# EAGLE design 16x8 mono LED FeatherWing rev A (EAGLE 6.4)
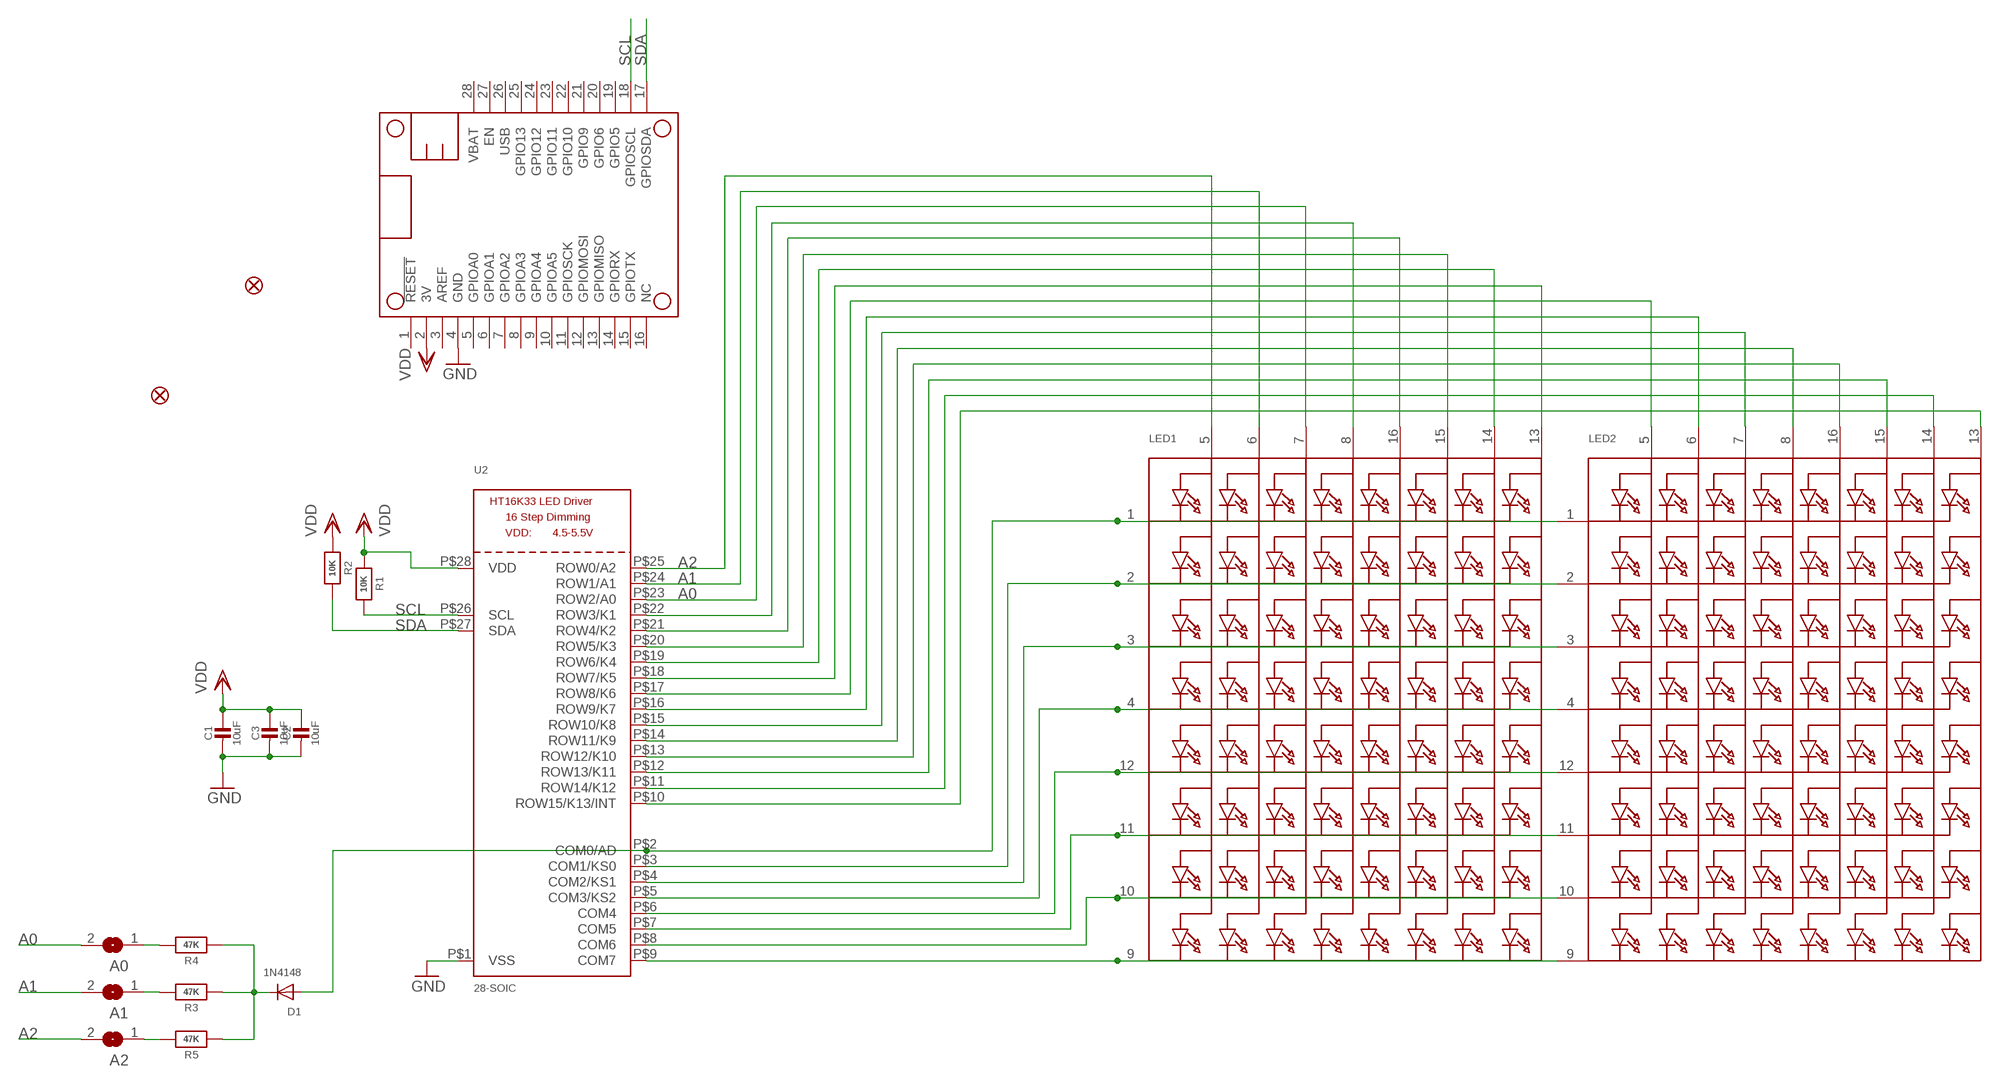
[diagram p0: schematic, sheet 1]

## Parts
A0  SOLDERJUMPERREFLOW_NOPASTE  [SOLDERJUMPER_REFLOW_NOPASTE]
A1  SOLDERJUMPERREFLOW_NOPASTE  [SOLDERJUMPER_REFLOW_NOPASTE]
A2  SOLDERJUMPERREFLOW_NOPASTE  [SOLDERJUMPER_REFLOW_NOPASTE]
C1  10uF  CAP_CERAMIC0805-NOOUTLINE  [0805-NO]
C2  10uF  CAP_CERAMIC0805-NOOUTLINE  [0805-NO]
C3  10uF  CAP_CERAMIC0805-NOOUTLINE  [0805-NO]
D1  1N4148  DIODESOD-323F  [SOD-323F]
FID1  FIDUCIAL""  [FIDUCIAL_1MM]
FID2  FIDUCIAL""  [FIDUCIAL_1MM]
LED1  DISP_SEGMENT_8X8_ROWCATHODE  [SEGMENT_BL-M07C881UR]
LED2  DISP_SEGMENT_8X8_ROWCATHODE  [SEGMENT_BL-M07C881UR]
MS1  FEATHERWING  [FEATHERWING]
R1  10K  RESISTOR0805_NOOUTLINE  [0805-NO]
R2  10K  RESISTOR0805_NOOUTLINE  [0805-NO]
R3  47K  RESISTOR0805_NOOUTLINE  [0805-NO]
R4  47K  RESISTOR0805_NOOUTLINE  [0805-NO]
R5  47K  RESISTOR0805_NOOUTLINE  [0805-NO]
U2  28-SOIC  HT16K33_SOP28_SKINNY  [SOP28_300MIL_SKINNY]

## Nets
A0: A0.2 LED1.7(A3) U2.P$23(ROW2/A0)
A1: A1.2 LED1.6(A2) U2.P$24(ROW1/A1)
A2: A2.2 LED1.5(A1) U2.P$25(ROW0/A2)
GND: C1.2 C2.2 C3.2 MS1.4(GND) U2.P$1(VSS)
N$1: LED1.9(K8) LED2.9(K8) U2.P$9(COM7)
N$2: LED1.10(K7) LED2.10(K7) U2.P$8(COM6)
N$3: LED1.11(K6) LED2.11(K6) U2.P$7(COM5)
N$4: LED1.12(K5) LED2.12(K5) U2.P$6(COM4)
N$5: LED1.4(K4) LED2.4(K4) U2.P$5(COM3/KS2)
N$6: LED1.3(K3) LED2.3(K3) U2.P$4(COM2/KS1)
N$7: LED1.2(K2) LED2.2(K2) U2.P$3(COM1/KS0)
N$8: D1.A LED1.1(K1) LED2.1(K1) U2.P$2(COM0/AD)
N$9: A2.1 R5.2
N$10: LED2.14(A7) U2.P$11(ROW14/K12)
N$11: LED2.15(A6) U2.P$12(ROW13/K11)
N$12: LED2.13(A8) U2.P$10(ROW15/K13/INT)
N$16: D1.C R3.1 R4.1 R5.1
N$19: A1.1 R3.2
N$20: A0.1 R4.2
N$22: LED1.13(A8) U2.P$18(ROW7/K5)
N$23: LED1.14(A7) U2.P$19(ROW6/K4)
N$25: LED1.16(A5) U2.P$21(ROW4/K2)
N$26: LED1.8(A4) U2.P$22(ROW3/K1)
N$35: LED1.15(A6) U2.P$20(ROW5/K3)
N$38: LED2.5(A1) U2.P$17(ROW8/K6)
N$39: LED2.6(A2) U2.P$16(ROW9/K7)
N$40: LED2.8(A4) U2.P$14(ROW11/K9)
N$41: LED2.7(A3) U2.P$15(ROW10/K8)
N$42: LED2.16(A5) U2.P$13(ROW12/K10)
SCL: MS1.18(GPIOSCL) R1.2 U2.P$26(SCL)
SDA: MS1.17(GPIOSDA) R2.2 U2.P$27(SDA)
VDD: C1.1 C2.1 C3.1 MS1.2(3V) R1.1 R2.1 U2.P$28(VDD)
Unconnected: MS1.1(!RESET) MS1.3(AREF) MS1.5(GPIOA0) MS1.6(GPIOA1) MS1.7(GPIOA2) MS1.8(GPIOA3) MS1.9(GPIOA4) MS1.10(GPIOA5) MS1.11(GPIOSCK) MS1.12(GPIOMOSI) MS1.13(GPIOMISO) MS1.14(GPIORX) MS1.15(GPIOTX) MS1.16(NC) MS1.19(GPIO5) MS1.20(GPIO6) MS1.21(GPIO9) MS1.22(GPIO10) MS1.23(GPIO11) MS1.24(GPIO12) MS1.25(GPIO13) MS1.26(USB) MS1.27(EN) MS1.28(VBAT)

## Library data of the parts
A0 A1 A2 = microbuilder:SOLDERJUMPER: SMD Solder JUMPER Solder the two pads together to create a connection, or remove the solder to break it. REFLOW - Use this footprint for solder paste and reflow ovens. WAVE - Use this footprint for hand-soldering (larger pads). CLOSED - Has a trace between the two pads to ensure it is closed by default. The trace needs to be cut to disable the jumper, and can be closed again by creating a solder bridge between the two pads.
C1-C3 = microbuilder:CAP_CERAMIC: Ceramic Capacitors For new designs, use the packages preceded by an '_' character since they are more reliable: The following footprints should be used on most boards: _0402 - Standard footprint for regular board layouts _0603 - Standard footprint for regular board layouts _0805 - Standard footprint for regular board layouts _1206 - Standard footprint for regular board layouts For extremely tight-pitch boards where space is at a premium, the following 'micro-pitch' footprints can be used (smaller pads, no silkscreen outline, etc.): _0402MP - Micro-pitch footprint for very dense/compact boards _0603MP - Micro-pitch footprint for very dense/compact boards _0805MP - Micro-pitch footprint for very dense/compact boards _1206MP - Micro-pitch footprint for very dense/compact boards
D1 = adafruit:DIODE: Diode SMADIODE - SMA Surface Mount Package 20V 1A Schottky Diode Digikey: 641-1014-6-ND DO-1N4148 - Through Hole Small Current Diode SOD-123 20V 1 A (.5mV Vf) Schottky Diode - Digikey: MBRX120TPMSCT-ND SOD-323 10V 570mA (.38mV Vf, 3ns) Schottky Diode - Digikey: ZLLS410CT-ND SOD-523 30V 30mA Schottky Diode (RB751S-40TE61) - Digikey: RB751S-40TE61CT-ND SOT23-R/W - SOT23 Package (R = Solder Paste/Reflow Ovens, W = Hand-Soldering) BAT54Film 40V 300mA - Digikey: 497-7162-1-ND
FID1 FID2 = microbuilder:FIDUCIAL: Fiducial Alignment Points Various fiducial points for machine vision alignment.; BOM: EXCLUDE
LED1 LED2 = microbuilder:DISP_SEGMENT_8X8_ROWCATHODE: 8x8 LED Segment Displays: Row = Cathode 0.7" Red 8X8 Matrix, 1.9mm Round LEDs - BL-M07C881UR 1.2" Red 8x8 Matrix, 3.0mm Round LEDs - BL-M12A881UR 1.2" Red 8x8 Matrix, 3.0mm Square LEDs - BL-M12A883
MS1 = microbuilder:FEATHERWING
R1-R5 = microbuilder:RESISTOR: Resistors For new designs, use the packages preceded by an '_' character since they are more reliable: The following footprints should be used on most boards: _0402 - Standard footprint for regular board layouts _0603 - Standard footprint for regular board layouts _0805 - Standard footprint for regular board layouts _1206 - Standard footprint for regular board layouts For extremely tight-pitch boards where space is at a premium, the following 'micro-pitch' footprints can be used (smaller pads, no silkscreen outline, etc.): _0402MP - Micro-pitch footprint for very dense/compact boards _0603MP - Micro-pitch footprint for very dense/compact boards _0805MP - Micro-pitch footprint for very dense/compact boards _1206MP - Micro-pitch footprint for very dense/compact boards
U2 = microbuilder:HT16K33_SOP28

## Board
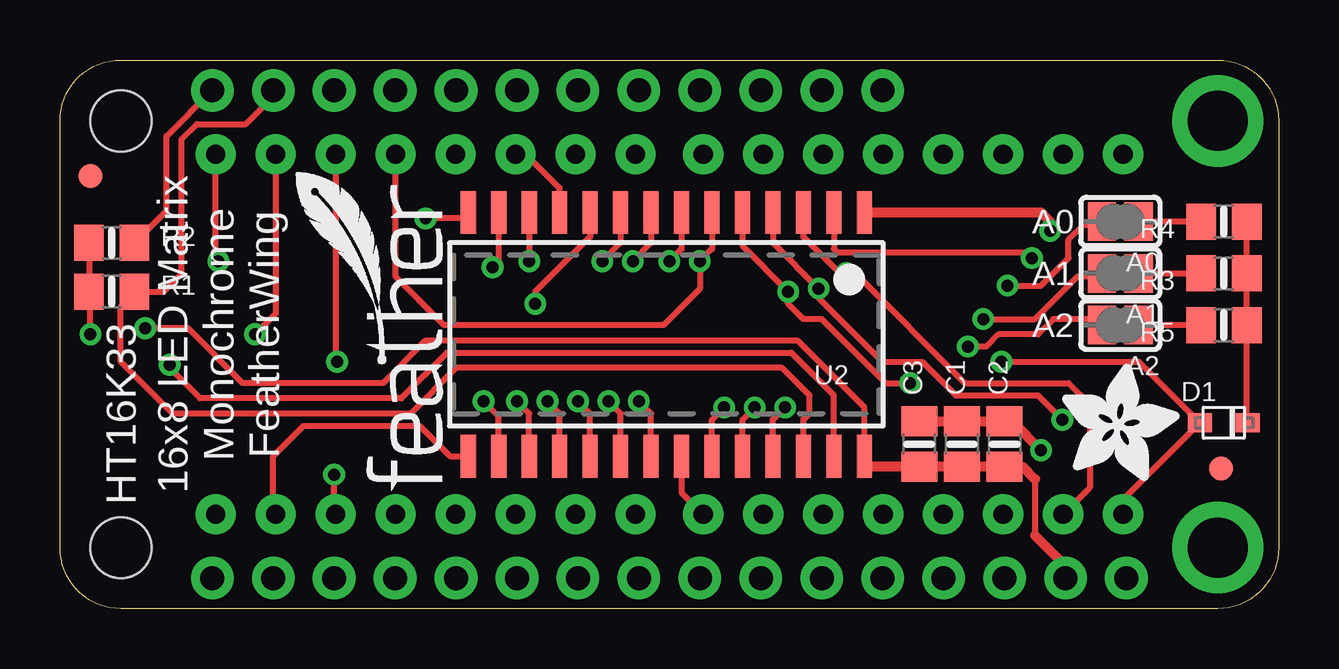
[diagram p1: board, top side]
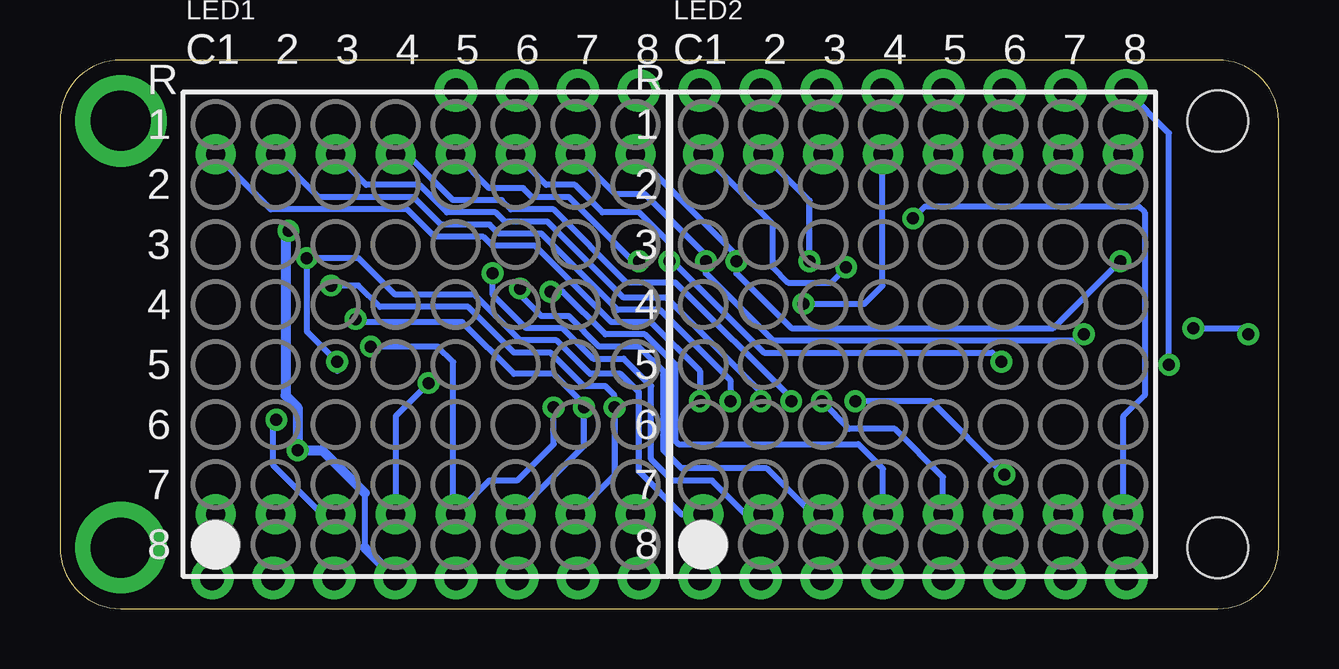
[diagram p2: board, bottom side, seen from below]

Size 50.8 x 22.86 mm. Coordinates in mm from the lower left corner, seen from the top.
Copper layers (1*16): Top 0.035mm / dielectric 1.5mm / Bottom 0.035mm
Design rules "adafruit *": minimum track width 8mil, minimum drill 15.5mil, track to track 8mil, track to pad 8mil, pad to pad 8mil, via to via 8mil, smd to smd 8mil, copper to edge 10mil, drill to drill 8mil, minimum pad ring 10mil, minimum via ring 8mil, stop-mask expansion 2mil, vias tented up to drill 20mil, thermal gap 10mil

### Footprints (pad centres in the part's own frame; a part is rotated, then mirrored left to right if it is on the bottom)
SOLDERJUMPER_REFLOW_NOPASTE = smd 1.168 x 1.6: 1 -0.762,0; 2 0.762,0
0805-NO = smd 1.24 x 1.5: 1 -0.95,0; 2 0.95,0
SOD-323F = smd 1 x 0.8: A -1,0; C 1,0
FIDUCIAL_1MM = smd 1 x 1: 1 0,0
SEGMENT_BL-M07C881UR = drill 0.8 pad 1.676: 1 -8.75,-7.5; 2 -6.25,-7.5; 3 -3.75,-7.5; 4 -1.25,-7.5; 5 1.25,-7.5; 6 3.75,-7.5; 7 6.25,-7.5; 8 8.75,-7.5; 9 8.75,7.5; 10 6.25,7.5; 11 3.75,7.5; 12 1.25,7.5; 13 -1.25,7.5; 14 -3.75,7.5; 15 -6.25,7.5; 16 -8.75,7.5
FEATHERWING = drill 1 pad 1.778: 1 6.35,1.27; 2 8.89,1.27; 3 11.43,1.27; 4 13.97,1.27; 5 16.51,1.27; 6 19.05,1.27; 7 21.59,1.27; 8 24.13,1.27; 9 26.67,1.27; 10 29.21,1.27; 11 31.75,1.27; 12 34.29,1.27; 13 36.83,1.27; 14 39.37,1.27; 15 41.91,1.27; 16 44.45,1.27; 17 44.45,21.59; 18 41.91,21.59; 19 39.37,21.59; 20 36.83,21.59; 21 34.29,21.59; 22 31.75,21.59; 23 29.21,21.59; 24 26.67,21.59; 25 24.13,21.59; 26 21.59,21.59; 27 19.05,21.59; 28 16.51,21.59 | drill 2.5 pad 3.81: P$1 2.54,20.32; P$2 2.54,2.54 | hole 2.54: 48.26,20.32; 48.26,2.54
SOP28_300MIL_SKINNY = smd 0.635 x 1.778: P$1 -8.255,-5.08; P$2 -6.985,-5.08; P$3 -5.715,-5.08; P$4 -4.445,-5.08; P$5 -3.175,-5.08; P$6 -1.905,-5.08; P$7 -0.635,-5.08; P$8 0.635,-5.08; P$9 1.905,-5.08; P$10 3.175,-5.08; P$11 4.445,-5.08; P$12 5.715,-5.08; P$13 6.985,-5.08; P$14 8.255,-5.08; P$15 8.255,5.08; P$16 6.985,5.08; P$17 5.715,5.08; P$18 4.445,5.08; P$19 3.175,5.08; P$20 1.905,5.08; P$21 0.635,5.08; P$22 -0.635,5.08; P$23 -1.905,5.08; P$24 -3.175,5.08; P$25 -4.445,5.08; P$26 -5.715,5.08; P$27 -6.985,5.08; P$28 -8.255,5.08

### Placement (x,y rotation side)
A0  44.2,16.13 180 top
A1  44.2,13.97 180 top
A2  44.2,11.81 180 top
C1  37.59,6.86 90 top
C2  39.37,6.86 90 top
C3  35.81,6.86 90 top
D1  48.51,7.75 0 top
FID1  1.27,18.03 0 top
FID2  48.39,5.84 0 top
LED1  35.56,11.43 0 bottom
LED2  15.24,11.43 0 bottom
MS1  50.8,0 0 bottom
R1  2.16,13.21 0 top
R2  2.16,15.24 0 top
R3  48.51,13.97 180 top
R4  48.51,16.13 180 top
R5  48.51,11.81 180 top
U2  25.27,11.43 180 top
U$1  [FEATHERLOGO_SMALL]  16,4.83 90 top
U$2  [ADAFRUIT_5MM]  41.78,5.33 0 top

### Tracks (layer width: path | path; a pad name or v marks a point on that pad's centre or on a via)
A0  (via drill 0.5)
  Top 0.254: v39.5,13.46 40.89,13.46 42.04,14.61 42.04,15.37 42.67,16 43.31,16 A0.2 | U2.P$23 27.18,7.87 v27.69,8.38
  Bottom 0.254: v39.5,13.46 38.35,13.46 37.46,12.57 33.78,12.57 31.88,10.67 30.35,10.67 28.96,9.27 28.07,9.27 27.69,8.89 v27.69,8.38 27.69,5.55 LED1.7
A1  (via drill 0.5)
  Top 0.254: v38.48,12.06 40.64,12.06 42.42,13.84 43.31,13.84 A1.2 | U2.P$24 28.45,7.87 v28.96,8.38
  Bottom 0.254: LED1.6 28.96,6.78 v28.96,8.38 28.96,8.51 30.23,9.78 31.88,9.78 34.04,11.94 38.1,11.94 38.23,12.06 v38.48,12.06
A2  (via drill 0.5)
  Top 0.254: A2.2 43.18,12.06 41.4,12.06 40.77,11.43 39.12,11.43 38.61,10.92 v37.85,10.92 | U2.P$25 29.72,7.87 v30.23,8.38
  Bottom 0.254: v37.85,10.92 35.05,10.92 34.41,10.28 34.41,3.93 LED1.5 32.91,5.33 31.75,5.33 30.23,6.86 v30.23,8.38
GND  (via drill 0.5)
  Top 0.254: C2.2 39.69,7.81
  Top 0.406: C3.2 C1.2 C2.2 | U2.P$1 40.89,16.51 41.27,16.13 v41.27,15.75 | 39.69,7.81 v40.89,6.6
  Bottom 0.254: 38.1,4.83 38.1,2.54 | v41.27,15.75 41.4,15.62
  Bottom 0.406: 38.1,2.54 MS1.4 | 41.4,15.62 41.4,8.89 40.89,8.38 v40.89,6.6 39.88,6.6 38.1,4.83
N$1  (via drill 0.5)
  Top 0.254: v6.6,14.48 6.49,14.59 LED2.9 | U2.P$9 23.37,15.24 v22.61,14.48
  Bottom 0.254: LED1.9 22.61,14.73 v22.61,14.48 22.61,13.97 20.32,11.68 9.4,11.68 v6.6,14.48 | 6.6,18.82 LED2.9
N$2  (via drill 0.5)
  Top 0.254: LED2.10 8.99,12.29 v8.13,11.43 | U2.P$8 24.64,15.24 v23.88,14.48
  Bottom 0.254: LED1.10 27.65,17.27 26.42,17.27 23.88,14.73 v23.88,14.48 | v23.88,14.48 23.88,14.22 | v8.13,11.43 8.38,11.18 21.08,11.18 23.88,13.97 v23.88,14.48
N$3  (via drill 0.5)
  Top 0.254: LED2.11 11.49,10.35 v11.56,10.29 | U2.P$7 25.91,14.99 v25.4,14.48
  Bottom 0.254: LED1.11 30.53,17.65 29.34,17.65 28.19,16.51 26.67,16.51 25.4,15.24 v25.4,14.48 25.27,14.48 21.46,10.67 11.94,10.67 v11.56,10.29
N$4  (via drill 0.5)
  Top 0.254: LED2.12 13.99,13.82 16,11.81 25.15,11.81 26.67,13.34 v26.67,14.48 27.18,14.99 U2.P$6
  Bottom 0.254: LED1.12 32.91,17.53 31.5,17.53 31.11,17.14 29.59,17.14 26.92,14.48 v26.67,14.48
N$5  (via drill 0.5)
  Top 0.254: U2.P$5 28.45,15.11 v30.35,13.21 30.35,12.7 30.99,12.06 31.75,12.06 34.42,9.4 v35.43,9.4
  Bottom 0.254: LED2.4 16.49,5.82 17.53,6.86 25.02,6.86 25.15,6.99 25.15,10.16 26.42,11.43 28.07,11.43 29.84,13.21 v30.35,13.21 | 36.83,3.95 LED1.4 36.81,8.02 v35.43,9.4
N$6  (via drill 0.5)
  Top 0.254: U2.P$4 29.72,15.24 v31.62,13.34 31.62,12.95 34.29,10.29 35.94,10.29 37.34,8.89 40.77,8.89 v41.78,7.87
  Bottom 0.254: LED2.3 19.42,3.93 21.34,5.84 24.89,5.84 25.65,6.6 25.65,9.91 26.67,10.92 28.32,10.92 29.59,12.19 30.73,12.19 31.62,13.08 v31.62,13.34 | LED1.3 39.87,3.93 41.91,5.97 41.91,7.75 v41.78,7.87
N$7  (via drill 0.5)
  Top 0.254: U2.P$3 30.99,15.49 32.51,13.97 v32.77,13.97 33.15,13.97 37.72,9.4 42.04,9.4 42.93,8.51 42.93,5.05 LED1.2
  Bottom 0.254: LED2.2 22.22,3.93 23.62,5.33 25.27,5.33 26.16,6.22 26.16,9.27 27.3,10.41 28.57,10.41 29.84,11.68 31.37,11.68 32.77,13.08 v32.77,13.97
N$8  (via drill 0.5)
  Top 0.254: LED1.1 44.31,4.54 D1.A 44.97,10.29 v39.24,10.29 | U2.P$2 32.26,14.99 32.38,14.86 40.26,14.86 v40.51,14.61
  Bottom 0.254: LED2.1 24.88,3.93 26.67,5.71 26.67,9.02 27.43,9.78 28.7,9.78 30.1,11.18 31.62,11.18 33.53,13.08 36.83,13.08 38.35,14.61 v40.51,14.61 40.51,11.56 v39.24,10.29 39.24,9.91 | 44.2,4.04 LED1.1
N$9
  Top 0.254: R5.2 A2.1
N$10
  Top 0.254: U2.P$11 20.83,17.53 19.56,18.8 19.12,18.8 LED2.14
N$11  (via drill 0.5)
  Top 0.254: U2.P$12 v19.56,14.48
  Bottom 0.254: v19.56,14.48 19.56,17 LED2.15
N$12  (via drill 0.5)
  Top 0.254: U2.P$10 22.1,15.49 19.81,13.21 v19.81,12.7
  Bottom 0.254: v19.81,12.7 17.27,12.7 16.51,13.46 16.51,18.91 LED2.13
N$16
  Top 0.254: D1.C 49.46,7.8 R5.1 R3.1 R4.1
N$19
  Top 0.254: A1.1 R3.2
N$20
  Top 0.254: R4.2 A0.1
N$22  (via drill 0.5)
  Top 0.254: U2.P$18 20.83,8.13 v20.32,8.64
  Bottom 0.254: LED1.13 36.33,18.93 34.42,17.02 32.38,17.02 32,16.64 30.23,16.64 27.18,13.59 25.15,13.59 20.32,8.76 v20.32,8.64
N$23  (via drill 0.5)
  Top 0.254: U2.P$19 22.1,8.13 v21.59,8.64
  Bottom 0.254: LED1.14 38.03,17.65 35.81,17.65 34.67,16.51 32.64,16.51 32.26,16.13 30.48,16.13 27.3,12.95 25.53,12.95 21.59,9.02 v21.59,8.64
N$25  (via drill 0.5)
  Top 0.254: U2.P$21 24.64,8.13 v24.13,8.64
  Bottom 0.254: LED1.16 42.02,16.64 36.32,16.64 35.18,15.49 33.15,15.49 32.77,15.11 30.99,15.11 27.81,11.94 26.16,11.94 24.13,9.91 v24.13,8.64
N$26
  Top 0.254: U2.P$22 25.91,4.83 LED1.8
N$35  (via drill 0.5)
  Top 0.254: U2.P$20 23.37,8.13 v22.86,8.64
  Bottom 0.254: LED1.15 40.02,17.14 36.07,17.14 34.92,16 32.89,16 32.51,15.62 30.73,15.62 27.56,12.45 25.78,12.45 22.86,9.53 v22.86,8.64
N$38  (via drill 0.5)
  Top 0.254: U2.P$17 19.56,8.13 v19.05,8.64
  Bottom 0.254: LED2.5 13.99,5.48 16,7.49 17.91,7.49 v19.05,8.64
N$39  (via drill 0.5)
  Top 0.254: LED2.6 11.43,3.99 v11.43,5.59 | U2.P$16 18.29,8 v17.65,8.64
  Bottom 0.254: v11.43,5.59 14.48,8.64 v17.65,8.64
N$40  (via drill 0.5)
  Top 0.254: U2.P$14 16.76,16.26 v15.24,16.26
  Bottom 0.254: v15.24,16.26 14.73,16.76 5.84,16.76 5.59,16.51 5.59,8.89 6.49,7.99 LED2.8
N$41
  Top 0.254: LED2.7 8.89,4.03 8.89,6.35 10.16,7.62 14.99,7.62 16.26,6.35 U2.P$15
N$42  (via drill 0.5)
  Top 0.254: U2.P$13 18.29,14.48 v18.03,14.22
  Bottom 0.254: LED2.16 21.08,16.02 21.08,14.22 20.45,13.59 18.67,13.59 v18.03,14.22
SCL
  Top 0.254: R1.2 4.32,13.21 5.08,13.97 5.08,19.56 5.71,20.19 7.75,20.19 8.89,21.34 MS1.18 | U2.P$26 30.99,7.87 31.24,8.13 31.24,8.89 30.1,10.03 16.51,10.03 14.6,8.13 4.7,8.13 2.54,10.29 2.54,12.57 3.11,13.14 R1.2 | 3.05,13.21 R1.2
SDA  (via drill 0.5)
  Top 0.254: R2.2 4.45,16.58 4.45,19.68 MS1.17 | U2.P$27 32.26,8.89 30.48,10.67 16.13,10.67 14.22,8.76 5.84,8.76 4.57,10.03 v4.57,10.16
  Bottom 0.254: v4.57,10.16 4.57,19.81 MS1.17
VDD  (via drill 0.5)
  Top 0.254: R2.1 R1.1 1.27,13.15 v1.27,11.43 | U2.P$28 33.72,6.16 | 40.64,5.4 40.64,3.05 | U2.P$28 33.53,8.38 30.73,11.18 15.24,11.18 13.46,9.4 7.62,9.4 5.33,11.68 v3.56,11.68 | 40.13,5.91 C2.1 | 33.53,5.91 U2.P$28
  Top 0.406: C2.1 C1.1 C3.1 33.53,5.91 | 40.64,3.05 41.91,1.78 MS1.2 | 40.64,5.4 40.13,5.91
  Bottom 0.254: v3.56,11.68 1.52,11.68 v1.27,11.43

### Text on the board
tPlace: A0 | A1 | 16x8 LED Matrix / Monochrome / FeatherWing | A2 | HT16K33